# Altium schematic sheet УШЯИ.467444.130Э3_5-A.SchDoc
size 420 x 297 mm; SheetNumber: 5; SheetTotal: 5
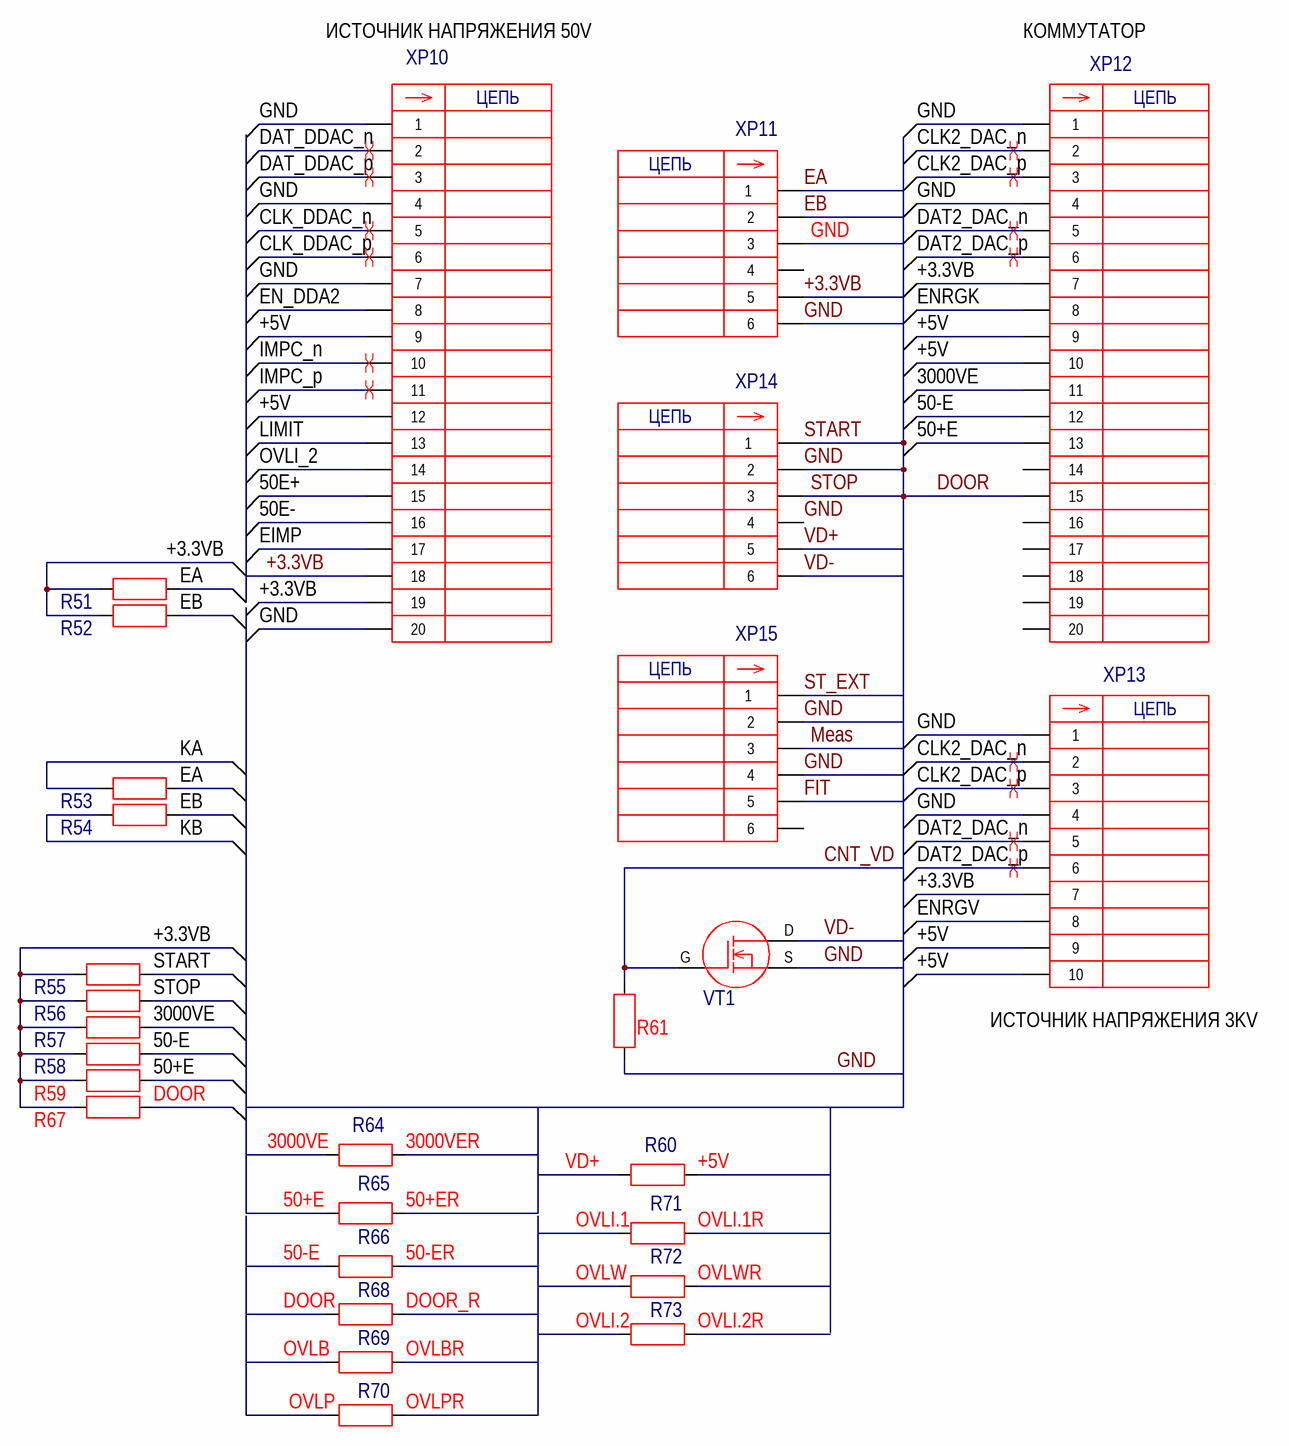
[diagram p0: УШЯИ.467444.130Э3_5-A.SchDoc]

## Parts
R51  10k  [R_0805 [2012 Metric]]  (value not drawn)
R52  10k  [R_0805 [2012 Metric]]  (value not drawn)
R53  10k  [R_0805 [2012 Metric]]  (value not drawn)
R54  10k  [R_0805 [2012 Metric]]  (value not drawn)
R55  10k  [R_0805 [2012 Metric]]  (value not drawn)
R56  10k  [R_0805 [2012 Metric]]  (value not drawn)
R57  10k  [R_0805 [2012 Metric]]  (value not drawn)
R58  10k  [R_0805 [2012 Metric]]  (value not drawn)
R59  10k  [R_0805 [2012 Metric]]  (value not drawn)
R60  10k  [R_0805 [2012 Metric]]  (value not drawn)
R61  10k  [R_1206 [3216 Metric]]  (value not drawn)
R64  10k  [R_0805 [2012 Metric]]  (value not drawn)
R65  10k  [R_0805 [2012 Metric]]  (value not drawn)
R66  10k  [R_0805 [2012 Metric]]  (value not drawn)
R67  10k  [R_0805 [2012 Metric]]  (value not drawn)
R68  10k  [R_0805 [2012 Metric]]  (value not drawn)
R69  10k  [R_0805 [2012 Metric]]  (value not drawn)
R70  10k  [R_0805 [2012 Metric]]  (value not drawn)
R71  10k  [R_0805 [2012 Metric]]  (value not drawn)
R72  10k  [R_0805 [2012 Metric]]  (value not drawn)
R73  10k  [R_0805 [2012 Metric]]  (value not drawn)
VT1  NDS7002A  [SOT-23-3_[TO-236AB]_Transistor_n]  (value not drawn)
XP10  BH2-20R  [BH2-20R]  (value not drawn)
XP11  AMPMODU II 280372-2  [AMP II-280372-2]  (value not drawn)
XP12  BH2-20R  [BH2-20R]  (value not drawn)
XP13  BH2-10R  [BH2-10R]  (value not drawn)
XP14  AMPMODU II 280372-2  [AMP II-280372-2]  (value not drawn)
XP15  AMPMODU II 280372-2  [AMP II-280372-2]  (value not drawn)

## Nets
50+E: R59.2 R65.1 XP12.13
50+ER: R65.2
50-E: R58.2 R66.1 XP12.12
50-ER: R66.2
50E+: XP10.15
50E-: XP10.16
3000VE: R57.2 R64.1 XP12.11
3000VER: R64.2
+3.3VB: R51.1 R52.1 R55.1 R56.1 R57.1 R58.1 R59.1 R67.1 XP10.18 XP10.19 XP11.5 XP12.7 XP13.7
+5V: R60.2 XP10.9 XP10.12 XP12.9 XP12.10 XP13.9 XP13.10
CLK2_DAC_n: XP12.2 XP13.2
CLK2_DAC_p: XP12.3 XP13.3
CLK_DDAC_n: XP10.5
CLK_DDAC_p: XP10.6
CNT_VD: R61.2 VT1.G(З)
DAT2_DAC_n: XP12.5 XP13.5
DAT2_DAC_p: XP12.6 XP13.6
DAT_DDAC_n: XP10.2
DAT_DDAC_p: XP10.3
DOOR: R55.2 R56.2 R61.1 R67.2 R68.1 VT1.S(И) XP10.1 XP10.4 XP10.7 XP10.20 XP11.3 XP11.6 XP12.1 XP12.4 XP12.15 XP13.1 XP13.4 XP14.1 XP14.2 XP14.3 XP14.4 XP15.2 XP15.4  [also labelled GND, START, STOP]
DOOR_R: R68.2
EA: R51.2 R53.2 XP11.1
EB: R52.2 R54.2 XP11.2
EIMP: XP10.17
EN_DDA2: XP10.8
ENRGK: XP12.8
ENRGV: XP13.8
FIT: XP15.5
IMPC_n: XP10.10
IMPC_p: XP10.11
KA: R53.1
KB: R54.1
LIMIT: XP10.13
Meas: XP15.3
OVLB: R69.1
OVLBR: R69.2
OVLI.1: R71.1
OVLI.1R: R71.2
OVLI.2: R73.1
OVLI.2R: R73.2
OVLI_2: XP10.14
OVLP: R70.1
OVLPR: R70.2
OVLW: R72.1
OVLWR: R72.2
ST_EXT: XP15.1
VD+: R60.1 XP14.5
VD-: VT1.D(C) XP14.6

Not connected (* = marked no-connect by the designer): XP11 4; XP12 14 16 17 18 19 20; XP15 6

## Layout directives
differential pair: CLK2_DAC_n, CLK2_DAC_p, CLK_DDAC_n, CLK_DDAC_p, DAT2_DAC_n, DAT2_DAC_p, DAT_DDAC_n, DAT_DDAC_p, IMPC_n, IMPC_p

## Notes on the sheet
- ИСТОЧНИК НАПРЯЖЕНИЯ 50V
- КОММУТАТОР
- (near XP13) ИСТОЧНИК НАПРЯЖЕНИЯ 3KV
- Подп. дата
- Инв. № дубл.
- Взам. инв. №
- Подп. и дата
- Инв. № подл.
- Изм.
- Лист
- № докум.
- Подп.
- Дата
- ALTIUM GOSTBOM2.0 KEV
- Файл:
- Копировал
- Формат А3
- (in symbol Conn_2) ЦЕПЬ
- (in symbol Conn_31) ЦЕПЬ
- (in symbol Conn_32) ЦЕПЬ

## Library data of the parts
R51-R60 R64-R73 = Res_57: ID: Res_57; Component Name: Резистор 0805-10 кОм ±1%; Tolerance: ±1%; Resistance: 10k; Height: 0.7mm; Weight, kg: 0,000006; Case / Package: 0805 [2012 Metric]
R61 = Res_15: ID: Res_15; Component Name: Резистор 1206-10 кОм ±5%; Tolerance: ±5%; Resistance: 10k; Case / Package: 1206 [3216 Metric]; Height: 0.7mm; Weight, kg: 0,0000162
VT1 = Trans_1: Транзистор n-канальный, изолированный затвор; Manufacturer: Onsemi; Component Name: Транзистор NDS7002A; Catalogue: DIGI-KEY NDS7002ATR-ND; ID: Trans_1; Device: NDS7002A; Datasheet: https://www.onsemi.com/pdf/datasheet/nds7002a-d.pdf; Height: 1.11mm; Weight, kg: 0,000008
XP10 XP12 = Conn_31: Male, 20 pins, 2 rows, Right Angle, DS1014-20RF1B-B, 2 mm; Manufacturer: Connfly electronic; Component Name: Вилка BH2-20R; Catalogue: ChipDip 8027300167; Крепёж: Не нужно; ID: Conn_31; Device: BH2-20R; Datasheet: https://static.chipdip.ru/lib/525/DOC059525726.pdf; Height: 5.6mm; Weight, kg: 0,0016
XP11 XP14 XP15 = Conn_2: Male, 6 pin, 1 row, Vertical, Board-to-Board, 2.54 mm; Manufacturer: TE Connectivity; ID: Conn_2; Component Name: Вилка AMPMODU II 280372-2; Catalogue: TE Internal 280372-2; Крепёж: Не нужно; Device: AMPMODU II 280372-2; Datasheet: https://www.te.com/usa-en/product-280372-2.datasheet.pdf; Height: 12.8mm; Weight, kg: 0,0013
XP13 = Conn_32: Male, 10 pins, 2 rows, Vertical, DS1014-10RF1B-B, 2 mm; Manufacturer: Connfly electronic; Component Name: Вилка BH2-10R; Catalogue: ChipDip 8144058573; Крепёж: Не нужно; ID: Conn_32; Device: BH2-10R; Datasheet: https://static.chipdip.ru/lib/525/DOC059525726.pdf; Height: 5.6mm; Weight, kg: 0,00071